# Altium schematic sheet 3V-Switcher-50mA.SCHDOC
size A4; Organization: UNSW Solar Racing Team; Address3: UNSW; Address4: Sydney NSW 2052; Address2: Electrical Engineering; Address1: Rm 109
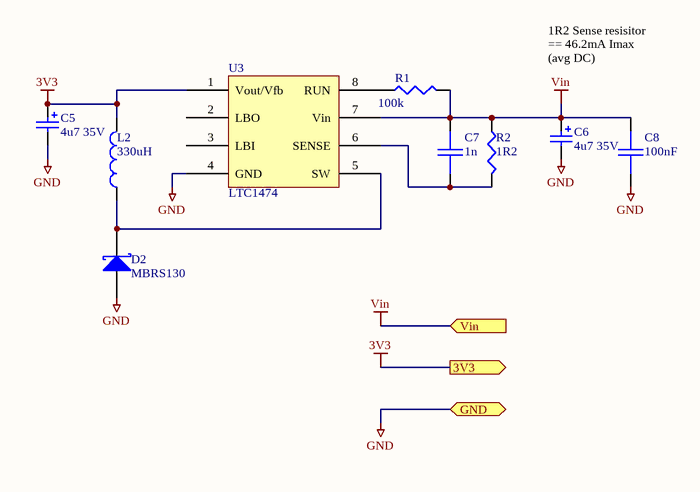
[diagram p0: 3V-Switcher-50mA.SCHDOC]

## Parts
C5  4u7 35V  [MCCT-CASEC]
C6  4u7 35V  [MCCT-CASEC]
C7  1n  [0603]
C8  100nF  [0603]
D2  MBRS130  [SMB]
L2  330uH  [1812]
R1  100k  [0603]
R2  1R2  [0603]
U3  LTC1474  [SO8]

## Ports
3V3, GND, Vin (in)

## Nets
3V3: C5.1 L2.2 U3.1(Vout/Vfb) ; port 3V3
GND: C5.2 C6.2 C8.2 D2.A U3.4(GND) ; port GND
Vin: C6.1 C7.1 C8.1 R1.2 R2.1 U3.7(Vin) ; port Vin
NetC7_2: C7.2 R2.2 U3.6(SENSE)
NetD2_K: D2.K L2.1 U3.5(SW)
NetR1_1: R1.1 U3.8(RUN)

Not connected (* = marked no-connect by the designer): U3 2(LBO) 3(LBI)

## Notes on the sheet
- 1R2 Sense resisitor == 46.2mA Imax (avg DC)
- Title
- Size:
- Date:
- A4
- Number:
- Time:
- Revision:
- Sheet
- of
- File:

## Library data of the parts
C5 C6 = Cap Pol3: Polarized Capacitor (Surface Mount); Value: 4.7uF; Needed?: Farnell; Revision: July-2002: Re-released for DXP Platform.; Farnell: 1844256; Farnell Price: 0.075
C7 = CAP: Capacitor; Value: 1nF; Needed?: NO - HW LAB; Revision: July-2002: Re-released for DXP Platform.
C8 = CAP: Capacitor; Needed?: NO - HW LAB; Revision: July-2002: Re-released for DXP Platform.; Value: 100nF
D2 = D SCHOTTKY: Schottky Diode; Needed?: Unsure - RS; RS: 625-5278; RS Price: 0.39; Revision: July-2002: Re-released for DXP Platform.; Farnell: 708-150; Farnell Price: 2.09
L2 = Inductor: Needed?: Not Used; Revision: July-2002: Re-released for DXP Platform.; Value: 330uH; Farnell: 200-451; Farnell Price: 2.90
R1 = RES1: Resistor; Needed?: NO - HW LAB; Value: 100k
R2 = RES1: Resistor; Value: 1.2R; Needed?: Farnell; Revision: July-2002: Re-released for DXP Platform.; Farnell: 1811627; Farnell Price: 0.044
U3 = LTC1474: Step-down converter; Needed?: Not Used